# EAGLE design ATEM-Tally-Camera-Light (EAGLE 7.7.0)
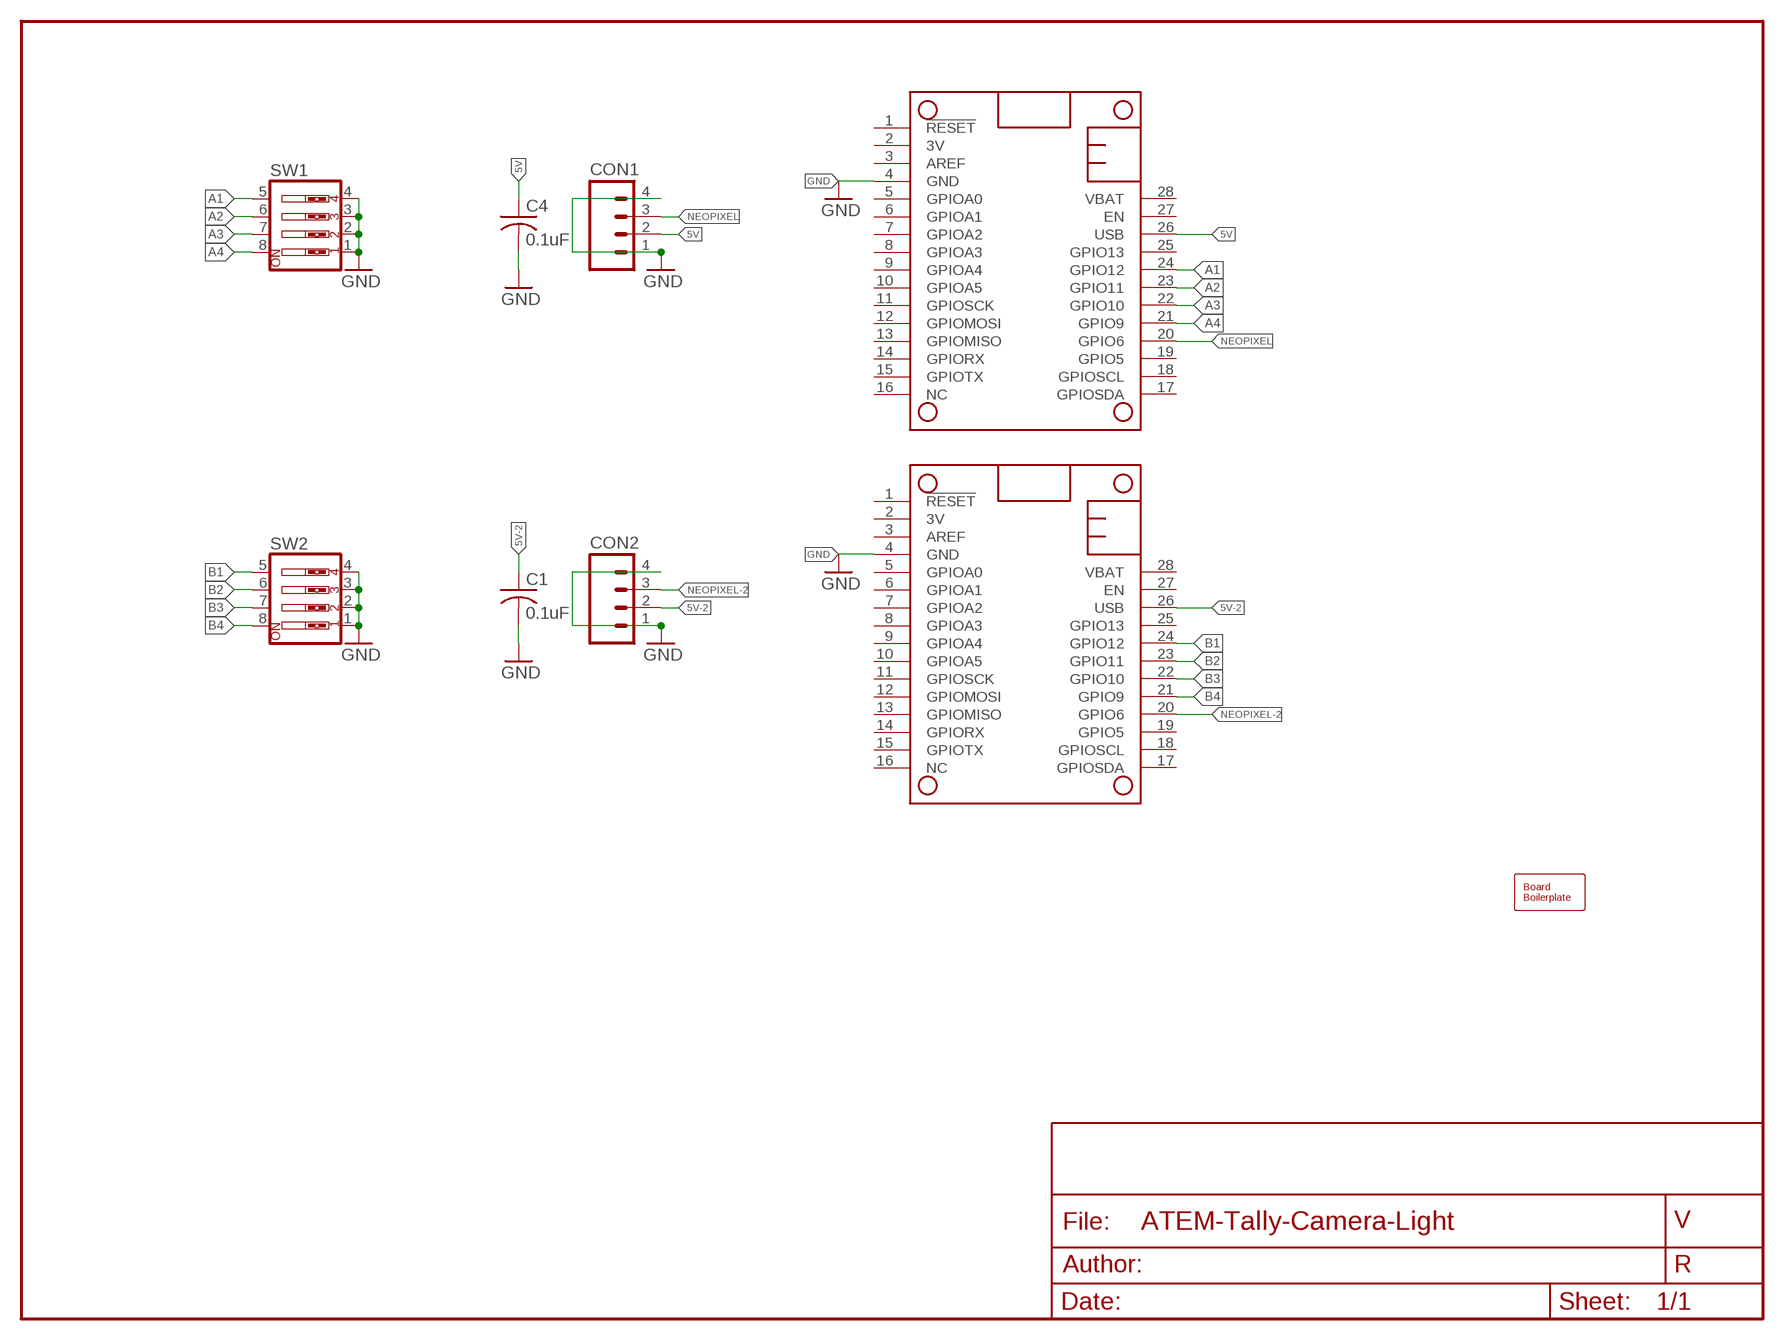
[diagram p0: schematic, sheet 1]

## Parts
BOARD1  BOARD80X50  [BOARD-DINRAIL-3.17INX5CM]
C1  0.1uF  CAP0603  [0603-CAP]
C4  0.1uF  CAP0603  [0603-CAP]
CON1  CONNECTOR-M04LOCK  [1X04_LOCK]
CON2  CONNECTOR-M04LOCK  [1X04_LOCK]
MS1  FEATHERWING_NODIM  [FEATHERWING_DIM]
MS2  FEATHERWING_NODIM  [FEATHERWING_DIM]
SW1  SW_DIP-4  [EDG-04]
SW2  SW_DIP-4  [EDG-04]

## Nets
5V: C4.1 CON1.2 MS1.26(USB)
5V-2: C1.1 CON2.2 MS2.26(USB)
A1: MS1.24(GPIO12) SW1.5
A2: MS1.23(GPIO11) SW1.6
A3: MS1.22(GPIO10) SW1.7
A4: MS1.21(GPIO9) SW1.8
B1: MS2.24(GPIO12) SW2.5
B2: MS2.23(GPIO11) SW2.6
B3: MS2.22(GPIO10) SW2.7
B4: MS2.21(GPIO9) SW2.8
GND: C1.2 C4.2 CON1.1 CON1.4 CON2.1 CON2.4 MS1.4(GND) MS2.4(GND) SW1.1 SW1.2 SW1.3 SW1.4 SW2.1 SW2.2 SW2.3 SW2.4
NEOPIXEL: CON1.3 MS1.20(GPIO6)
NEOPIXEL-2: CON2.3 MS2.20(GPIO6)
Unconnected: MS1.1(!RESET) MS1.2(3V) MS1.3(AREF) MS1.5(GPIOA0) MS1.6(GPIOA1) MS1.7(GPIOA2) MS1.8(GPIOA3) MS1.9(GPIOA4) MS1.10(GPIOA5) MS1.11(GPIOSCK) MS1.12(GPIOMOSI) MS1.13(GPIOMISO) MS1.14(GPIORX) MS1.15(GPIOTX) MS1.16(NC) MS1.17(GPIOSDA) MS1.18(GPIOSCL) MS1.19(GPIO5) MS1.25(GPIO13) MS1.27(EN) MS1.28(VBAT) MS2.1(!RESET) MS2.2(3V) MS2.3(AREF) MS2.5(GPIOA0) MS2.6(GPIOA1) MS2.7(GPIOA2) MS2.8(GPIOA3) MS2.9(GPIOA4) MS2.10(GPIOA5) MS2.11(GPIOSCK) MS2.12(GPIOMOSI) MS2.13(GPIOMISO) MS2.14(GPIORX) MS2.15(GPIOTX) MS2.16(NC) MS2.17(GPIOSDA) MS2.18(GPIOSCL) MS2.19(GPIO5) MS2.25(GPIO13) MS2.27(EN) MS2.28(VBAT)

## Library data of the parts
BOARD1 = SPCoast:BOARD
C1 C4 = SPCoast:CAP*
CON1 CON2 = SPCoast:CONNECTOR-M04: Header 4 Standard 4-pin 0.1" header. Use with straight break away headers (SKU : PRT-00116), right angle break away headers (PRT-00553), swiss pins (PRT-00743), machine pins (PRT-00117), and female headers (PRT-00115). Molex polarized connector foot print use with SKU : PRT-08231 with associated crimp pins and housings. 1MM SMD Version SKU: PRT-10208
MS1 MS2 = adafruit:FEATHERWING
SW1 SW2 = SPCoast:SW_DIP-4: DIP SWITCH

## Board
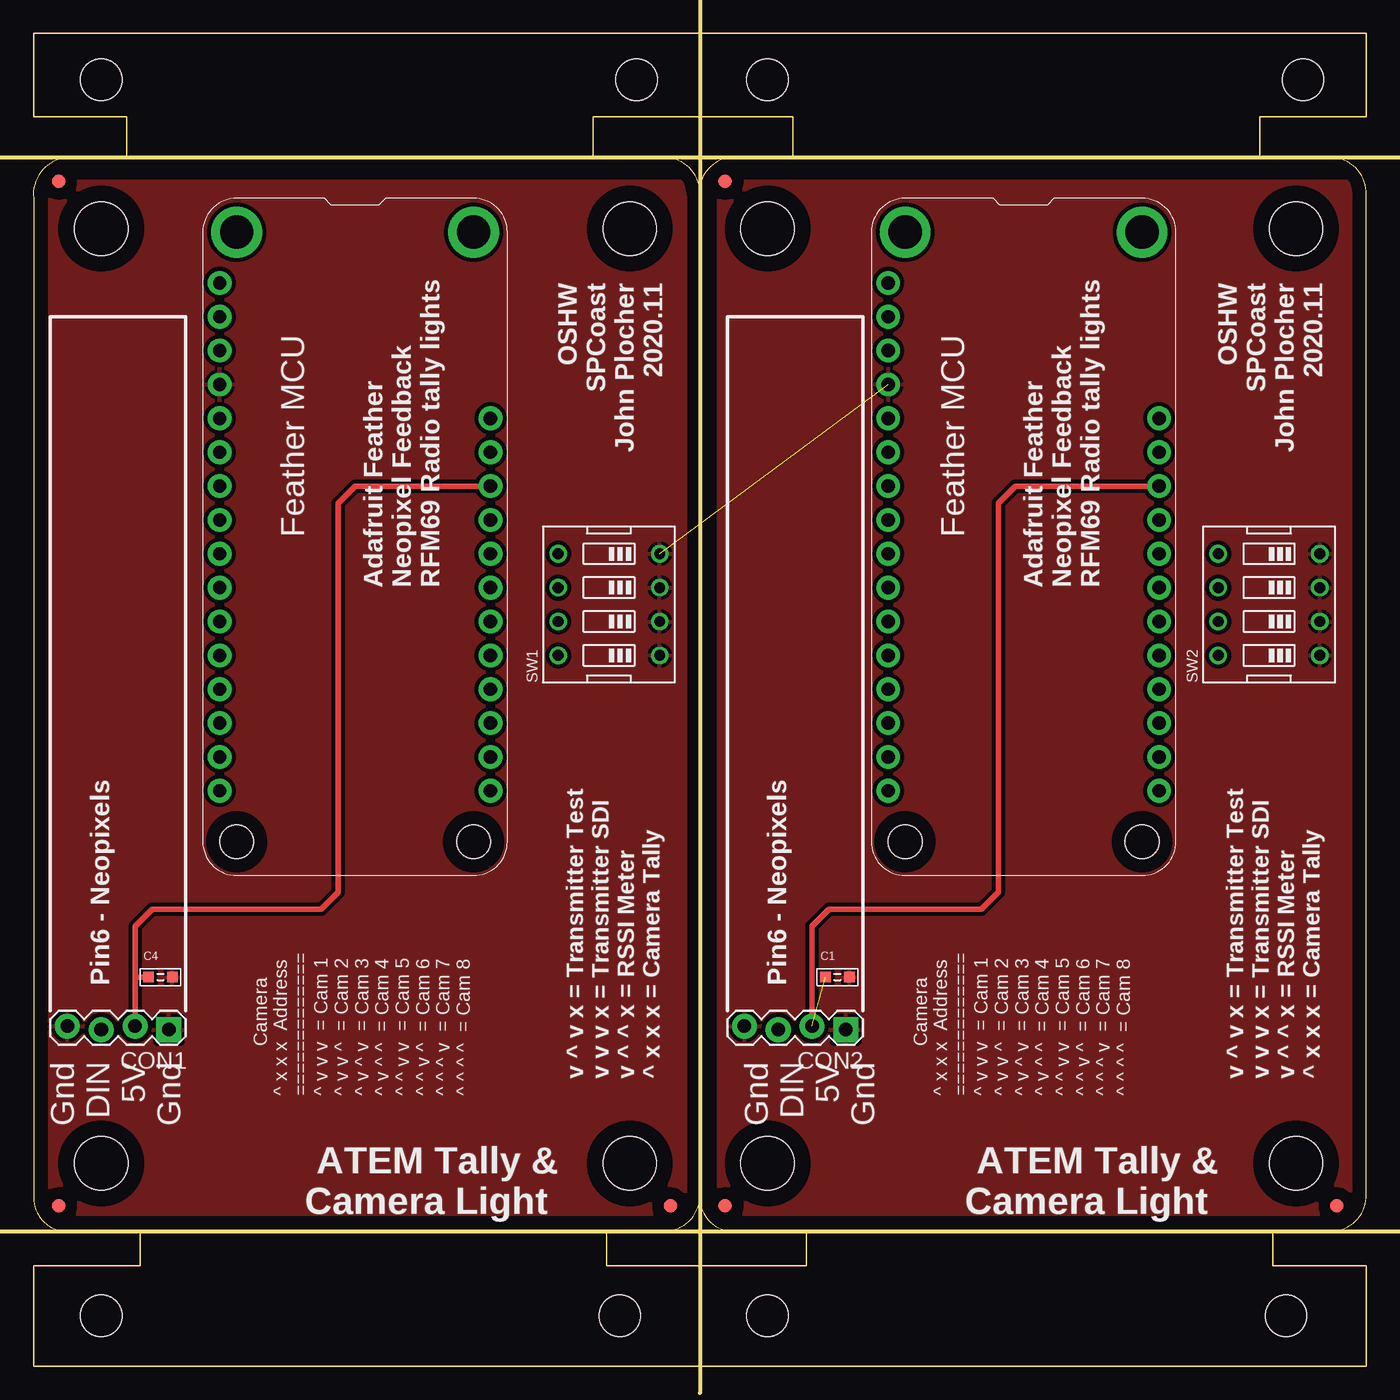
[diagram p1: board, top side]
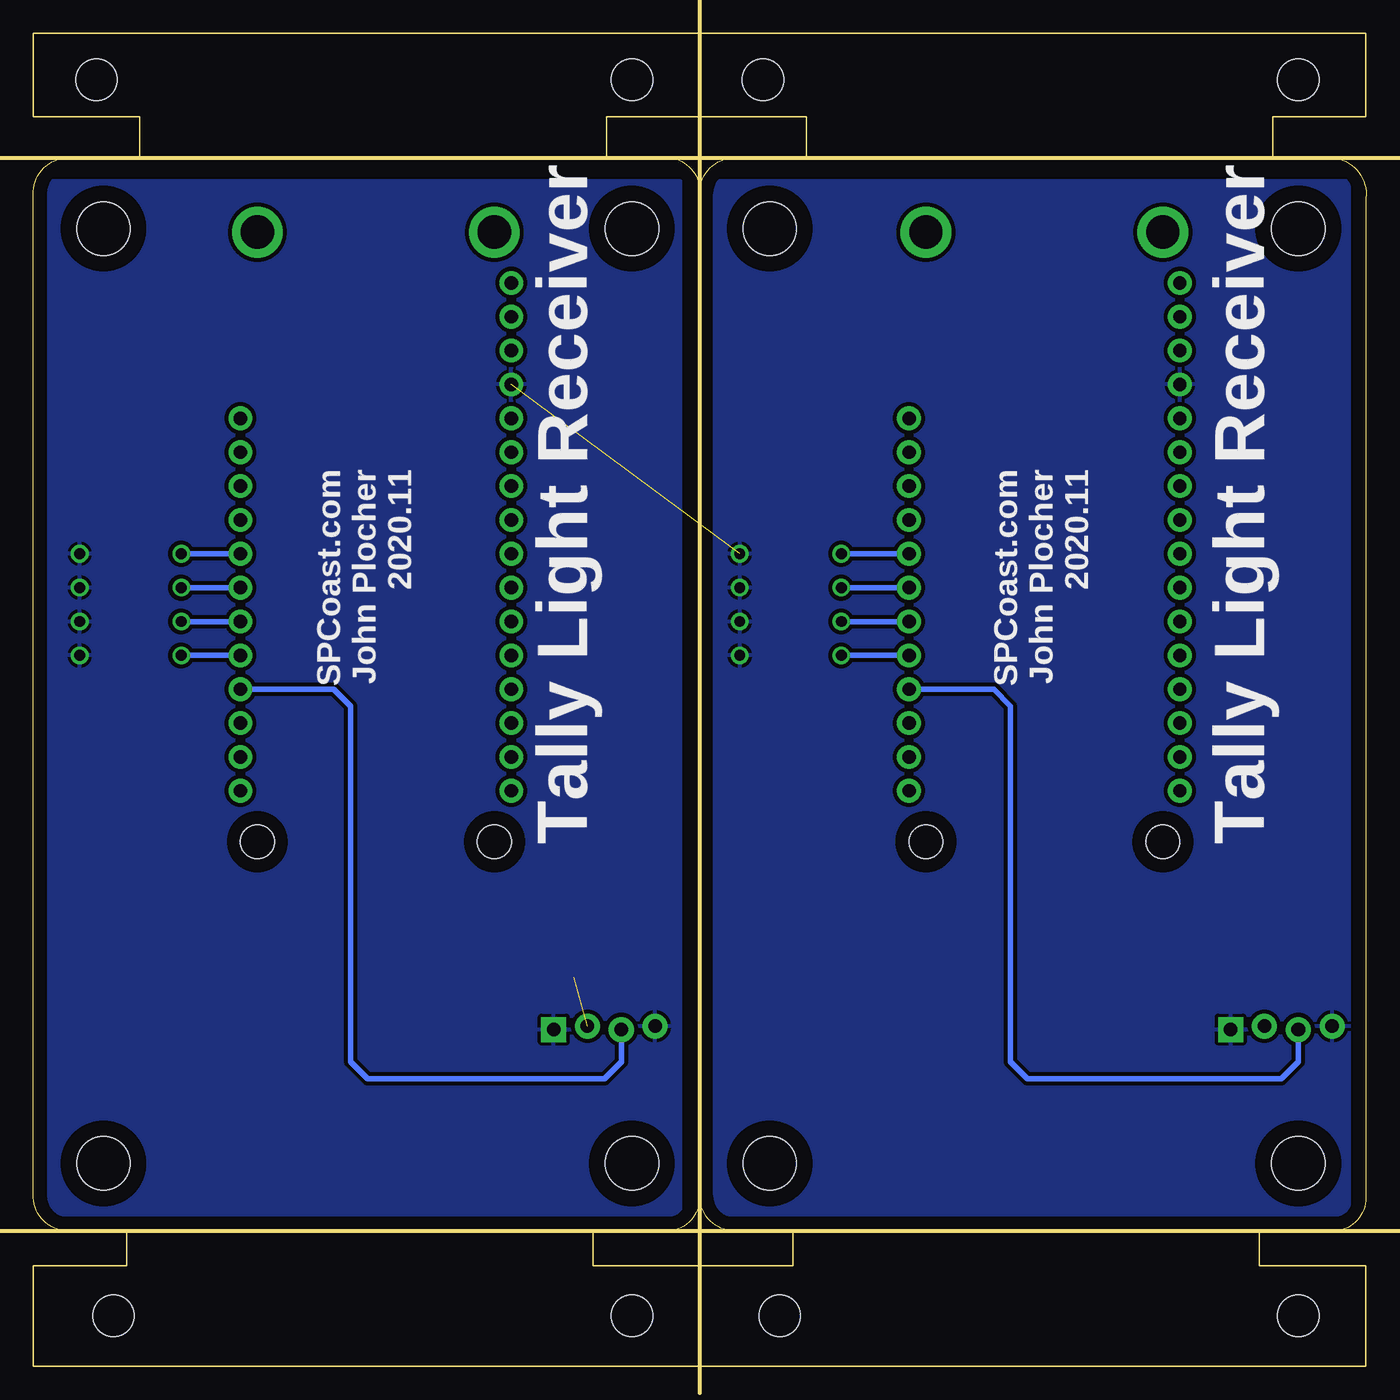
[diagram p2: board, bottom side, seen from below]

Size 100.01 x 100 mm. Coordinates in mm from the lower left corner, seen from the top.
Copper layers (1*16): Top 0.035mm / dielectric 1.5mm / Bottom 0.035mm
Design rules "default": minimum track width 10mil, minimum drill 24mil, track to track 8mil, track to pad 8mil, pad to pad 8mil, via to via 8mil, smd to smd 8mil, copper to edge 40mil, drill to drill 8mil, minimum pad ring 10mil, minimum via ring 8mil, stop-mask expansion 4mil, vias tented up to drill 0mil, thermal gap 10mil

### Footprints (pad centres in the part's own frame; a part is rotated, then mirrored left to right if it is on the bottom)
BOARD-DINRAIL-3.17INX5CM = smd 1 x 1: 1 1.905,12.065; 2 47.79,12.065; 3 1.905,88.9; 4 51.905,12.065; 5 97.79,12.065; 6 51.905,88.9 | hole 4: 44.742,15.24; 5.08,85.344; 44.742,85.344; 5.08,15.24; 94.742,15.24; 55.08,85.344; 94.742,85.344; 55.08,15.24 | hole 3.1: 5.08,96.52; 45.25,96.52; 5.08,3.81; 43.98,3.81; 55.08,96.52; 95.25,96.52; 55.08,3.81; 93.98,3.81
0603-CAP = smd 0.813 x 0.813: 1 -0.9,0; 2 0.9,0
1X04_LOCK = drill 1.016 pad 1.88 square: 1 0,0.127 | drill 1.016 pad 1.88: 2 2.54,-0.127; 3 5.08,0.127; 4 7.62,-0.127
FEATHERWING_DIM = drill 1 pad 1.778: 1 6.35,1.27; 2 8.89,1.27; 3 11.43,1.27; 4 13.97,1.27; 5 16.51,1.27; 6 19.05,1.27; 7 21.59,1.27; 8 24.13,1.27; 9 26.67,1.27; 10 29.21,1.27; 11 31.75,1.27; 12 34.29,1.27; 13 36.83,1.27; 14 39.37,1.27; 15 41.91,1.27; 16 44.45,1.27; 17 44.45,21.59; 18 41.91,21.59; 19 39.37,21.59; 20 36.83,21.59; 21 34.29,21.59; 22 31.75,21.59; 23 29.21,21.59; 24 26.67,21.59; 25 24.13,21.59; 26 21.59,21.59; 27 19.05,21.59; 28 16.51,21.59 | drill 2.5 pad 3.81: P$1 2.54,20.32; P$2 2.54,2.54 | hole 2.54: 48.26,20.32; 48.26,2.54
EDG-04 = drill 0.813: 1 -3.81,-3.81; 2 -1.27,-3.81; 3 1.27,-3.81; 4 3.81,-3.81; 5 3.81,3.81; 6 1.27,3.81; 7 -1.27,3.81; 8 -3.81,3.81

### Placement (x,y rotation side)
BOARD1  0.01,0 0 top
C1  60.34,29.21 0 top
C4  9.54,29.21 0 top
CON1  10.17,25.4 180 top
CON2  60.97,25.4 180 top
MS1  12.71,87.63 270 top
MS2  62.88,87.63 270 top
SW1  43.19,57.15 90 top
SW2  92.72,57.15 90 top

### Tracks (layer width: path | path; a pad name or v marks a point on that pad's centre or on a via)
5V
  Top 0.406: 7.63,29.21 CON1.2 | C4.1 7.63,29.21 | MS1.26 24.14,66.04 22.87,64.77 22.87,35.56 21.6,34.29 8.9,34.29 7.63,33.02 7.63,29.21
5V-2  (1 unrouted)
  Top 0.406: MS2.26 73.67,66.04 72.4,64.77 72.4,35.56 71.13,34.29 59.7,34.29 58.43,33.02 CON2.2
A1
  Bottom 0.406: SW1.5 MS1.24
A2
  Bottom 0.406: SW1.6 MS1.23
A3
  Bottom 0.406: SW1.7 MS1.22
A4
  Bottom 0.406: SW1.8 MS1.21
B1
  Bottom 0.406: SW2.5 MS2.24
B2
  Bottom 0.406: SW2.6 MS2.23
B3
  Bottom 0.406: SW2.7 MS2.22
B4
  Bottom 0.406: SW2.8 MS2.21
GND  (1 unrouted)
  pour Top (isolate 0.305): 1.28,88.9 48.91,88.9 48.91,11.43 1.28,11.43
  pour Bottom (isolate 0.305): 1.28,88.9 48.91,88.9 48.91,11.43 1.28,11.43
  pour Bottom (isolate 0.305): 51.45,88.9 99.07,88.9 99.07,11.43 51.45,11.43
  pour Top (isolate 0.305): 51.45,88.9 99.07,88.9 99.07,11.43 51.45,11.43
NEOPIXEL
  Bottom 0.406: MS1.20 27.95,50.8 26.68,49.53 26.68,22.86 25.41,21.59 6.36,21.59 5.09,22.86 CON1.3
NEOPIXEL-2
  Bottom 0.406: MS2.20 77.48,50.8 76.21,49.53 76.21,22.86 74.94,21.59 57.16,21.59 55.89,22.86 CON2.3

### Text on the board
tPlace: OSHW / SPCoast / John Plocher / 2020.11 | OSHW / SPCoast / John Plocher / 2020.11 | Feather MCU | Feather MCU | Adafruit Feather / Neopixel Feedback / RFM69 Radio tally lights | Adafruit Feather / Neopixel Feedback / RFM69 Radio tally lights | Pin6 - Neopixels | Pin6 - Neopixels | Gnd / DIN / 5V / Gnd | Gnd / DIN / 5V / Gnd | v ^ v x = Transmitter Test / v v v x = Transmitter SDI / v ^ ^ x = RSSI Meter / ^ x x x = Camera Tally | v ^ v x = Transmitter Test / v v v x = Transmitter SDI / v ^ ^ x = RSSI Meter / ^ x x x = Camera Tally | Camera / ^ x x x Address / ============= / ^ v v v = Cam 1 / ^ v v ^ = Cam 2 / ^ v ^ v = Cam 3 / ^ v ^ ^ = Cam 4 / ^ ^ v v = Cam 5 / ^ ^ v ^ = Cam 6 / ^ ^ ^ v = Cam 7 / ^ ^ ^ ^ = Cam 8 | Camera / ^ x x x Address / ============= / ^ v v v = Cam 1 / ^ v v ^ = Cam 2 / ^ v ^ v = Cam 3 / ^ v ^ ^ = Cam 4 / ^ ^ v v = Cam 5 / ^ ^ v ^ = Cam 6 / ^ ^ ^ v = Cam 7 / ^ ^ ^ ^ = Cam 8 | ATEM Tally & / Camera Light | ATEM Tally & / Camera Light
bPlace: Tally Light Receiver | Tally Light Receiver | SPCoast.com / John Plocher / 2020.11 | SPCoast.com / John Plocher / 2020.11